# Altium schematic sheet Flex_Sensor.SchDoc
size A4; SheetNumber: 9; SheetTotal: 11
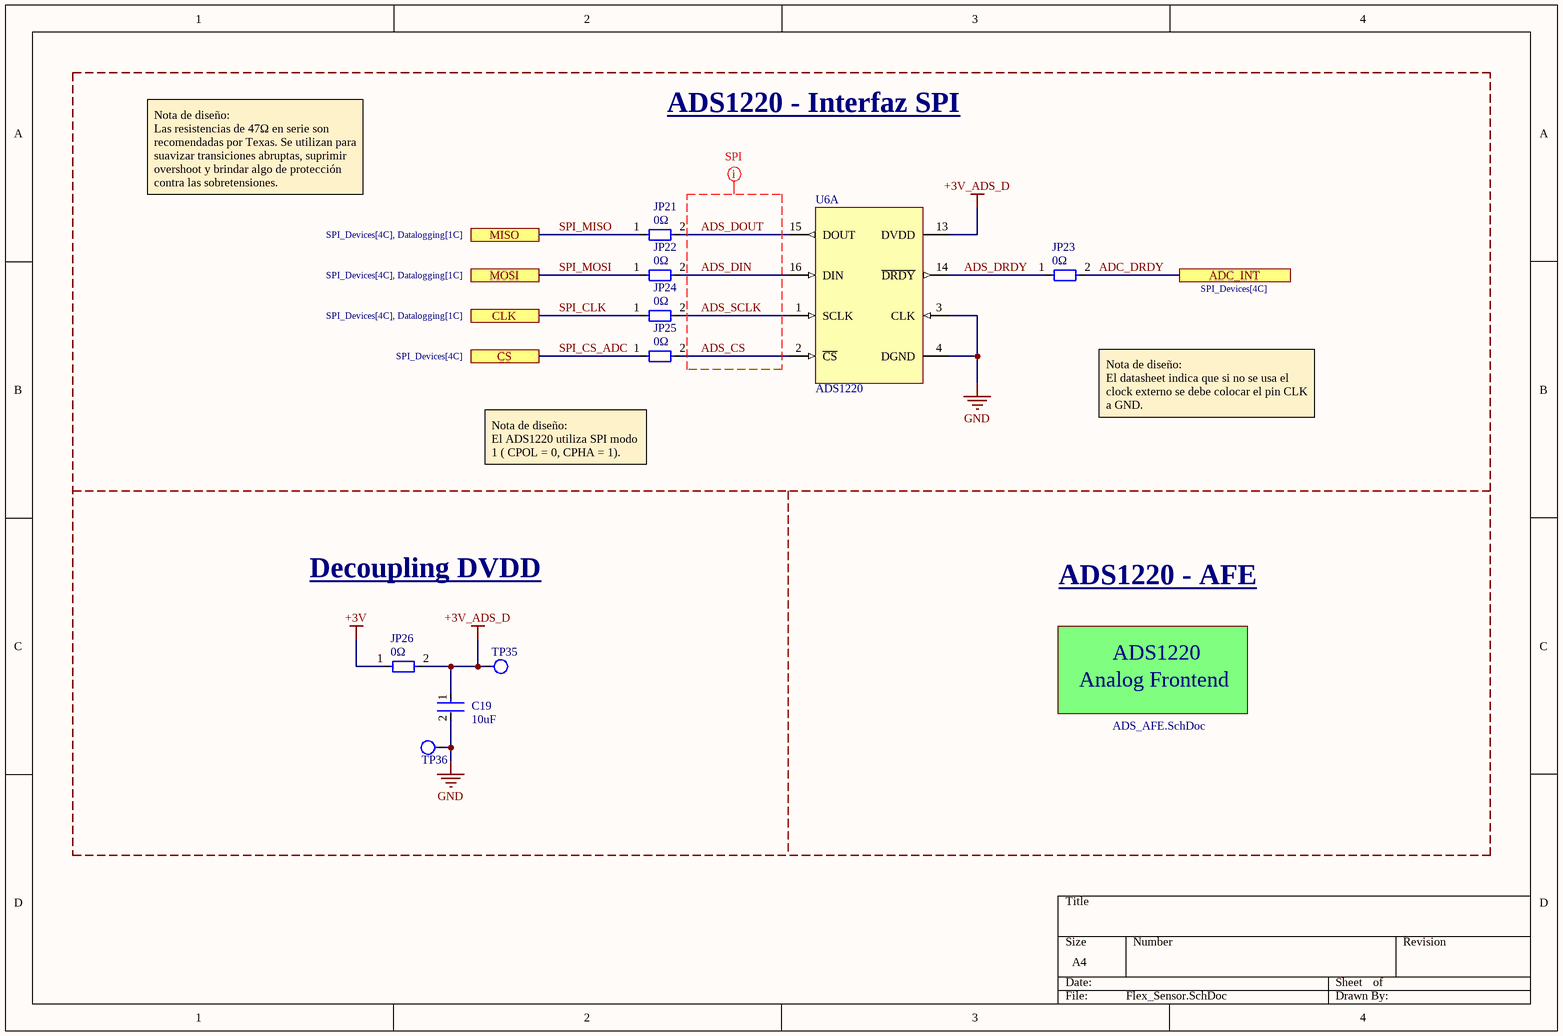
[diagram p0: Flex_Sensor.SchDoc]

## Parts
C19  10uF  [CAP_0603]
JP21  value 0Ω  [RES_0R_0603]  (hidden comment: Generic JP)  (no BOM)
JP22  value 0Ω  [RES_0R_0603]  (hidden comment: Generic JP)  (no BOM)
JP23  value 0Ω  [RES_0R_0603]  (hidden comment: Generic JP)  (no BOM)
JP24  value 0Ω  [RES_0R_0603]  (hidden comment: Generic JP)  (no BOM)
JP25  value 0Ω  [RES_0R_0603]  (hidden comment: Generic JP)  (no BOM)
JP26  value 0Ω  [RES_0R_0603]  (hidden comment: Generic JP)  (no BOM)
TP35  Testpoint SMD  [Testpoint_SMD]  (value not drawn)  (no BOM)
TP36  Testpoint SMD  [Testpoint_SMD]  (value not drawn)  (no BOM)
U6  ADS1220  [TSSOP-16]  (part A of 2)

## Sub-sheets
ADS_AFE = ADS_AFE.SchDoc: no entries  | Titulo: ADS1220; Titulo 2: Analog Frontend

## Ports
ADC_INT (see SPI_Devices[4C]), CLK (see SPI_Devices[4C], Datalogging[1C]), CS (see SPI_Devices[4C]), MISO (see SPI_Devices[4C], Datalogging[1C]), MOSI (see SPI_Devices[4C], Datalogging[1C])

## Nets
+3V: JP26.1
+3V_ADS_D: C19.1 JP26.2 TP35.1 U6.13(DVDD)
GND: C19.2 TP36.1 U6.3(CLK) U6.4(DGND)
ADC_DRDY: JP23.2 ; port ADC_INT
ADS_CS: JP25.2 U6.2(~{CS})
ADS_DIN: JP22.2 U6.16(DIN)
ADS_DOUT: JP21.2 U6.15(DOUT)
ADS_DRDY: JP23.1 U6.14(~{DRDY})
ADS_SCLK: JP24.2 U6.1(SCLK)
SPI_CLK: JP24.1 ; port CLK
SPI_CS_ADC: JP25.1 ; port CS
SPI_MISO: JP21.1 ; port MISO
SPI_MOSI: JP22.1 ; port MOSI

## Layout directives
net class SPI: ADS_CS, ADS_DIN, ADS_DOUT, ADS_SCLK

## Notes on the sheet
- ADS1220 - Interfaz SPI
- Nota de diseño:
  Las resistencias de 47Ω en serie son recomendadas por Texas. Se utilizan para suavizar transiciones abruptas, suprimir overshoot y brindar algo de protección contra las sobretensiones.
- Nota de diseño:
  El datasheet indica que si no se usa el clock externo se debe colocar el pin CLK a GND.
- Nota de diseño:
  El ADS1220 utiliza SPI modo 1 ( CPOL = 0, CPHA = 1).
- Decoupling DVDD
- ADS1220 - AFE

## Library data of the parts
C19 = Generic C: Cap 10 uF 10V X7R 0603; Dielectric: X5R; Tolerance: 10%; Case Code (Imperial): 0805; Capacitance: 10uF; Mount: Surface Mount; Depth: 1.25mm; Length: 2mm; Lead Free: Lead Free; Packaging: Tape and Reel; Width: 0.049inch; Package Quantity: 1; Height: 1.25mm; Case/Package: 0805; Voltage Rating: 10V; Thickness: 0.053inch; Max Operating Temperature: 85°C; Case Code (Metric): 2012; Contact Plating: Tin; Min Operating Temperature: -55°C; Radiation Hardening: No; Voltage Rating (DC): 10V
JP21-JP26 = Generic JP: Simbolo de jumper genérico
TP35 TP36 = Testpoint_SMD: Testpoint SMD de 1mm de diametro.
U6 = ADS1220: ADS1220 4-Channel, 2-kSPS, Low-Power, 24-Bit ADC with Integrated PGA and Reference